# EAGLE design PuM_Arduino_Shield_v2 (EAGLE 7.3.0)
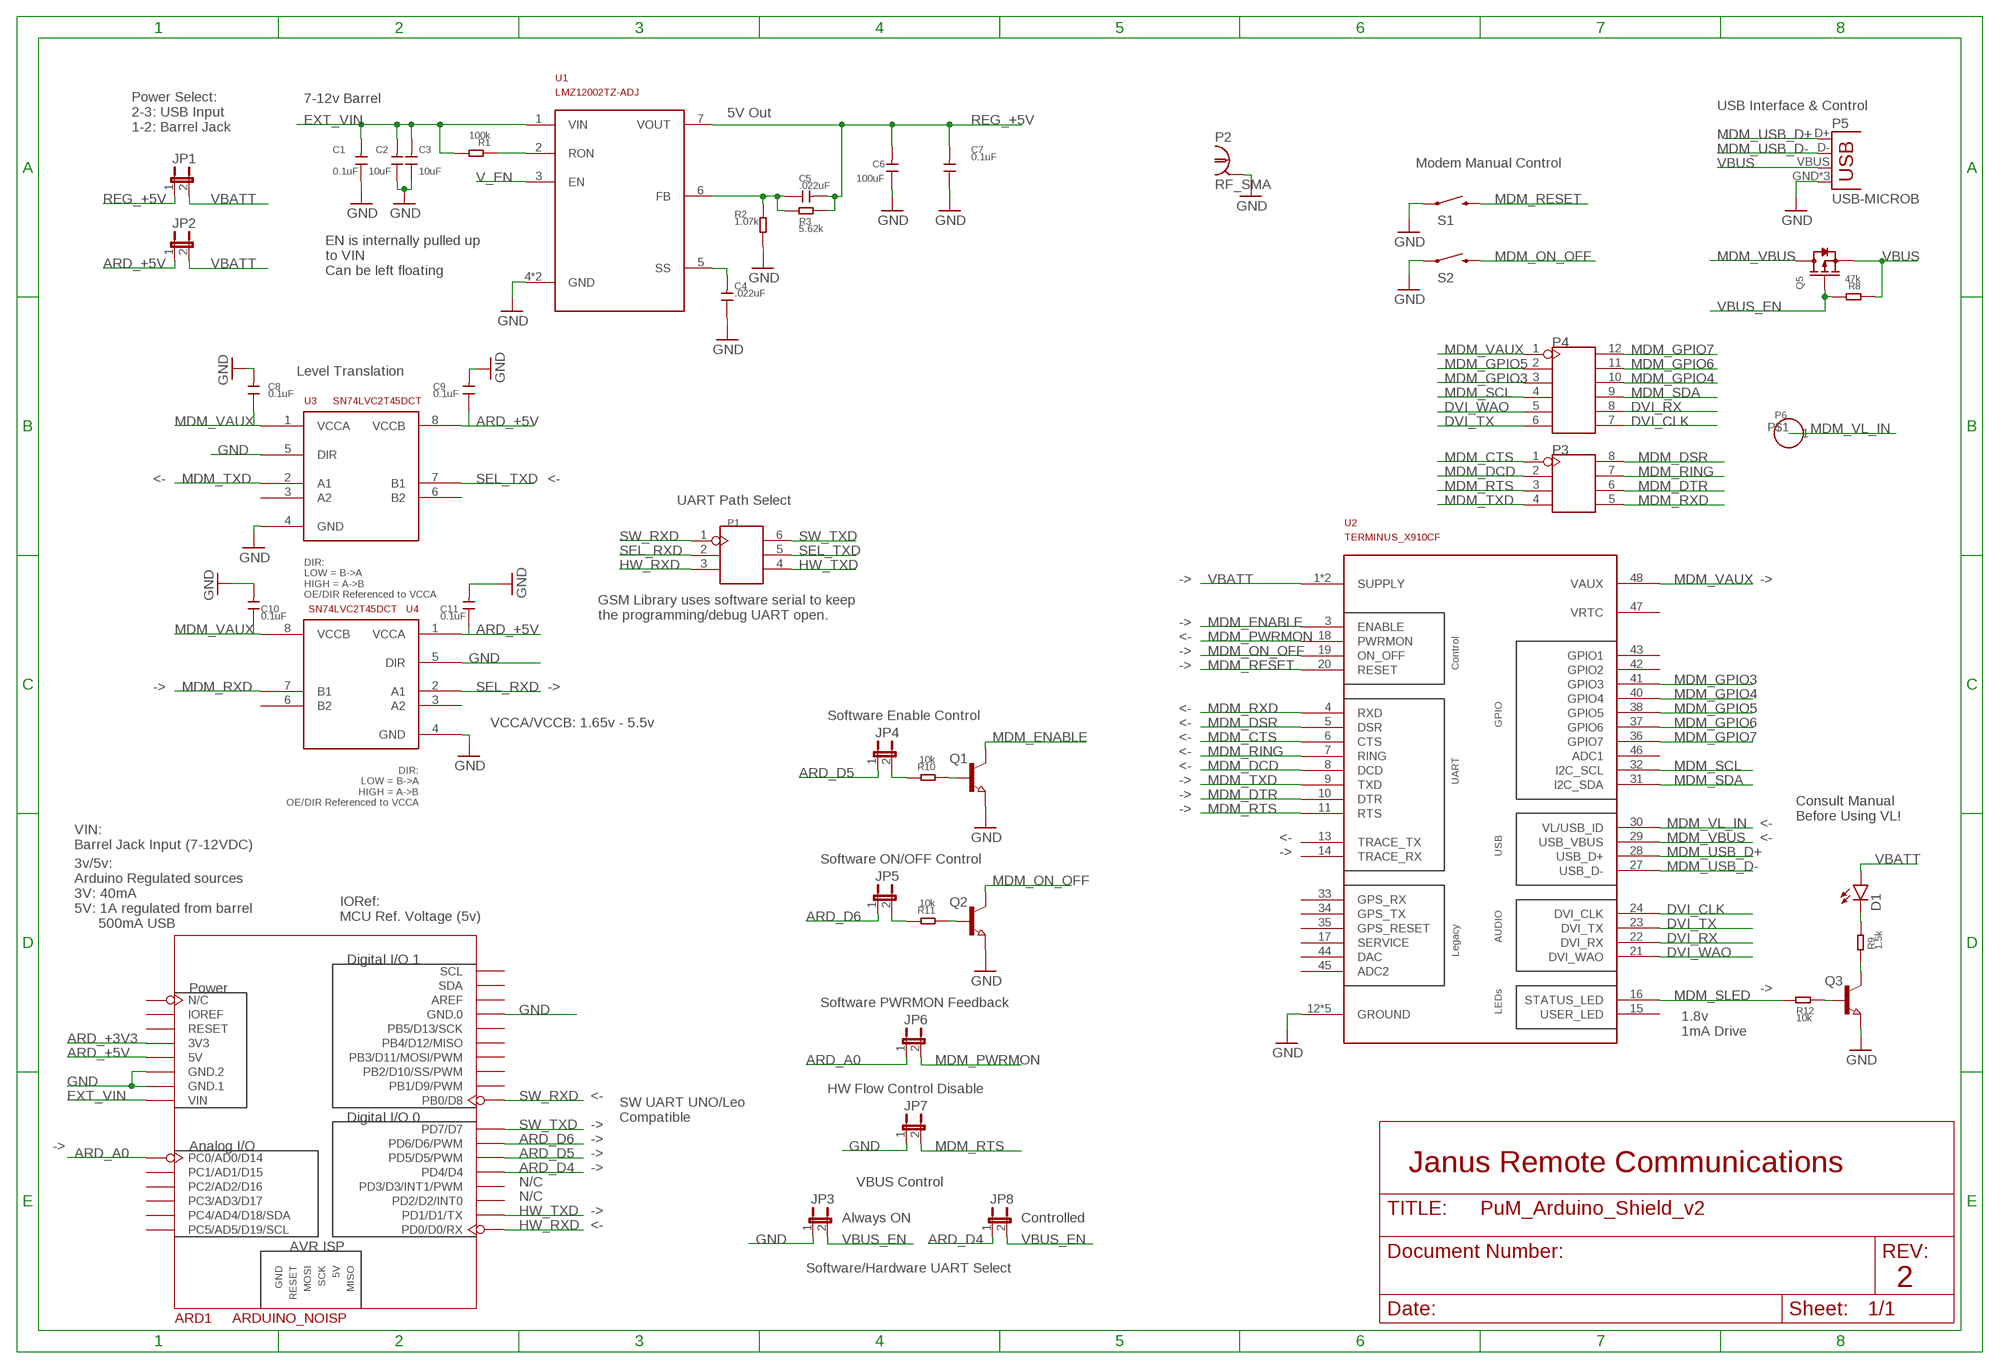
[diagram p0: schematic, sheet 1]

## Parts
ARD1  ARDUINO_NOISP  [ARDUINO_NOISP]
C1  0.1uF  C-0402  [C0402]
C2  10uF  C-0805  [C0805]
C3  10uF  C-0805  [C0805]
C4  .022uF  C-0402  [C0402]
C5  .022uF  C-0402  [C0402]
C6  100uF  C-1206  [C1206]
C7  0.1uF  C-0402  [C0402]
C8  0.1uF  C-0402  [C0402]
C9  0.1uF  C-0402  [C0402]
C10  0.1uF  C-0402  [C0402]
C11  0.1uF  C-0402  [C0402]
D1  LED0603  [LED-0603]
JP1  JUMPER-2SMD-NC  [SJ_2S]
JP2  JUMPER-2SMD-NO  [SJ_2S-NO]
JP3  JUMPER-2SMD-NO  [SJ_2S-NO]
JP4  JUMPER-2SMD-NC  [SJ_2S]
JP5  JUMPER-2SMD-NC  [SJ_2S]
JP6  JUMPER-2SMD-NC  [SJ_2S]
JP7  JUMPER-2SMD-NC  [SJ_2S]
JP8  JUMPER-2SMD-NC  [SJ_2S]
P1  HEADER-2X3P-2.54  [2X3P-2.54]
P2  RF_SMA  [RF_SMA_NOPIN]
P3  HEADER-2X4P-2.54  [2X4P-2.54]
P4  HEADER-2X6P-2.54  [2X6P-2.54]
P5  USB-MICROB  [USB-MICROB]
P6  HEADER-1P-35  [1P-65/35MIL]
Q1  NPN-TRANSISTOR_SOT23  [SOT23]
Q2  NPN-TRANSISTOR_SOT23  [SOT23]
Q3  NPN-TRANSISTOR_SOT23  [SOT23]
Q5  MOSFET-P'SI2323CDS/SI2305DS<BR>'  [SOT23]
R1  100k  R-0402  [R0402]
R2  1.07k  R-0402  [R0402]
R3  5.62k  R-0402  [R0402]
R8  47k  R-0402  [R0402]
R9  1.5k  R-0402  [R0402]
R10  10k  R-0402  [R0402]
R11  10k  R-0402  [R0402]
R12  10k  R-0402  [R0402]
S1  SWITCH-MOMENTARY-2SIDE_EZ  [TACTILE-PTH-SIDEEZ]
S2  SWITCH-MOMENTARY-2SIDE_EZ  [TACTILE-PTH-SIDEEZ]
U1  LMZ12002TZ-ADJ  [TO-PMOD-7]
U2  TERMINUS_X910CF  [X910CF]
U3  SN74LVC2T45DCT  [LSSOP-8]
U4  SN74LVC2T45DCT  [LSSOP-8]

## Nets
ARD_+3V3: ARD1.3V3
ARD_+5V: ARD1.5V C9.1 C11.1 JP2.1 U3.8(VCCB) U4.1(VCCA)
ARD_A0: ARD1.A0(PC0/AD0/D14) JP6.1
ARD_D4: ARD1.D4(PD4/D4) JP8.1
ARD_D5: ARD1.D5(PD5/D5/PWM) JP4.1
ARD_D6: ARD1.D6(PD6/D6/PWM) JP5.1
DVI_CLK: P4.7 U2.24(DVI_CLK)
DVI_RX: P4.8 U2.22(DVI_RX)
DVI_TX: P4.6 U2.23(DVI_TX)
DVI_WAO: P4.5 U2.21(DVI_WAO)
EXT_VIN: ARD1.VIN C1.2 C2.2 C3.2 R1.2 U1.1(VIN)
GND: ARD1.GND0(GND.0) ARD1.GND1(GND.1) ARD1.GND2(GND.2) C1.1 C2.1 C3.1 C4.1 C6.1 C7.1 C8.2 C9.2 C10.2 C11.2 JP3.1 JP7.1 P2.2 P2.3 P2.4 P2.5 P5.GND P5.MT1(GND) P5.MT2(GND) Q1.2(E) Q2.2(E) Q3.2(E) R2.2 S1.1 S2.1 U1.4(GND) U1.EP(GND) U2.12(GROUND) U2.25(GROUND) U2.26(GROUND) U2.39(GROUND) U2.49(GROUND) U3.4(GND) U3.5(DIR) U4.4(GND) U4.5(DIR)
HW_RXD: ARD1.D0(PD0/D0/RX) P1.3
HW_TXD: ARD1.D1(PD1/D1/TX) P1.4
MDM_CTS: P3.1 U2.6(CTS)
MDM_DCD: P3.2 U2.8(DCD)
MDM_DSR: P3.8 U2.5(DSR)
MDM_DTR: P3.6 U2.10(DTR)
MDM_ENABLE: Q1.3(C) U2.3(ENABLE)
MDM_GPIO3: P4.3 U2.41(GPIO3)
MDM_GPIO4: P4.10 U2.40(GPIO4)
MDM_GPIO5: P4.2 U2.38(GPIO5)
MDM_GPIO6: P4.11 U2.37(GPIO6)
MDM_GPIO7: P4.12 U2.36(GPIO7)
MDM_ON_OFF: Q2.3(C) S2.2 U2.19(ON_OFF)
MDM_PWRMON: JP6.2 U2.18(PWRMON)
MDM_RESET: S1.2 U2.20(RESET)
MDM_RING: P3.7 U2.7(RING)
MDM_RTS: JP7.2 P3.3 U2.11(RTS)
MDM_RXD: P3.5 U2.4(RXD) U4.7(B1)
MDM_SCL: P4.4 U2.32(I2C_SCL)
MDM_SDA: P4.9 U2.31(I2C_SDA)
MDM_SLED: R12.2 U2.16(STATUS_LED)
MDM_TXD: P3.4 U2.9(TXD) U3.2(A1)
MDM_USB_D+: P5.D+ U2.28(USB_D+)
MDM_USB_D-: P5.D- U2.27(USB_D-)
MDM_VAUX: C8.1 C10.1 P4.1 U2.48(VAUX) U3.1(VCCA) U4.8(VCCB)
MDM_VBUS: Q5.3(D) U2.29(USB_VBUS)
MDM_VL_IN: P6.P$1 U2.30(VL/USB_ID)
N$1: Q3.3(C) R9.2
N$2: JP5.2 R11.1
N$3: R1.1 U1.2(RON)
N$4: C4.2 U1.5(SS)
N$5: C5.1 R2.1 R3.2 U1.6(FB)
N$6: D1.C R9.1
N$7: JP4.2 R10.1
N$8: Q1.1(B) R10.2
N$9: Q2.1(B) R11.2
N$10: Q3.1(B) R12.1
REG_+5V: C5.2 C6.2 C7.2 JP1.1 R3.1 U1.7(VOUT)
SEL_RXD: P1.2 U4.2(A1)
SEL_TXD: P1.5 U3.7(B1)
SW_RXD: ARD1.D8(PB0/D8) P1.1
SW_TXD: ARD1.D7(PD7/D7) P1.6
V_EN: U1.3(EN)
VBATT: D1.A JP1.2 JP2.2 U2.1(SUPPLY) U2.2(SUPPLY)
VBUS: P5.VBUS Q5.2(S) R8.2
VBUS_EN: JP3.2 JP8.2 Q5.1(G) R8.1
Unconnected: ARD1.A1(PC1/AD1/D15) ARD1.A2(PC2/AD2/D16) ARD1.A3(PC3/AD3/D17) ARD1.A4(PC4/AD4/D18/SDA) ARD1.A5(PC5/AD5/D19/SCL) ARD1.AREF ARD1.D2(PD2/D2/INT0) ARD1.D3(PD3/D3/INT1/PWM) ARD1.D9(PB1/D9/PWM) ARD1.D10(PB2/D10/SS/PWM) ARD1.D11(PB3/D11/MOSI/PWM) ARD1.D12(PB4/D12/MISO) ARD1.D13(PB5/D13/SCK) ARD1.IOREF ARD1.N/C ARD1.RST(RESET) ARD1.SCL ARD1.SDA U2.13(TRACE_TX) U2.14(TRACE_RX) U2.15(USER_LED) U2.17(SERVICE) U2.33(GPS_RX) U2.34(GPS_TX) U2.35(GPS_RESET) U2.42(GPIO2) U2.43(GPIO1) U2.44(DAC) U2.45(ADC2) U2.46(ADC1) U2.47(VRTC) U3.3(A2) U3.6(B2) U4.3(A2) U4.6(B2)

## Notes on the sheet
- 7-12v Barrel
- USB Interface & Control
- 5V Out
- Power Select:
  2-3: USB Input
  1-2: Barrel Jack
- Modem Manual Control
- EN is internally pulled up 
  to VIN
  Can be left floating
- Level Translation
- <- | <-
- UART Path Select
- -> | ->
- GSM Library uses software serial to keep 
  the programming/debug UART open.
- ->
- <-
- ->
- ->
- -> | ->
- <-
- Software Enable Control
- VCCA/VCCB: 1.65v - 5.5v | <-
- <-
- <-
- <-
- ->
- ->
- ->
- Consult Manual 
  Before Using VL!
- <-
- <- | <-
- VIN:
  Barrel Jack Input (7-12VDC)
- ->
- Software ON/OFF Control
- IORef:
  MCU Ref. Voltage (5v)
- 3v/5v:
  Arduino Regulated sources
  3V: 40mA
  5V: 1A regulated from barrel
        500mA USB
- ->
- Software PWRMON Feedback
- 1.8v
  1mA Drive
- HW Flow Control Disable
- <-
- SW UART UNO/Leo
  Compatible
- ->
- ->
- ->
- ->
- -> | Janus Remote Communications
- N/C | VBUS Control
- N/C
- ->
- Always ON | Controlled
- <-
- Software/Hardware UART Select
- 2

## Library data of the parts
ARD1 = Janus-IC:ARDUINO
C1-C11 = Discrete:C*: Ceramic Capacitors
D1 = SparkFun-LED:LED: LEDs Standard schematic elements and footprints for 5mm, 3mm, 1206, and 0603 sized LEDs. 5mm - Spark Fun Electronics SKU : COM-00529 (and others)
JP1-JP8 = SparkFun-Retired:JUMPER-2: Jumper Basic 0.1" spaced jumper. Use with breakaway headers.
P1 = Connector:HEADER-2X3P
P2 = Janus-IC:RF_SMA: SMA Bulkhead connector
P3 = Connector:HEADER-2X4P
P4 = Connector:HEADER-2X6P
P5 = SparkFun-Connectors:USB: USB Connectors USB-B-PTH is fully proven SKU : PRT-00139/CONN-08278 USB-miniB is fully proven SKU : PRT-00587 USB-A-PCB is untested. USB-A-H is throughly reviewed, but untested. Spark Fun Electronics SKU : PRT-00437 USB-B-SMT is throughly reviewed, but untested. Needs silkscreen touching up. USB-A-S has not been used/tested USB-MB-H has not been used/tested USB-MICROB has been used. CONN-09505; PROD_ID: CONN-09505
P6 = Connector:HEADER-1P
Q1-Q3 = semicon-smd-ipc:NPN-TRANSISTOR_: NPN TRANSISTOR
Q5 = Discrete:MOSFET-P
R1-R3 R8-R12 = Discrete:R*
S1 S2 = SparkFun-Electromechanical:SWITCH-MOMENTARY-2: Various NO switches- pushbuttons, reed, etc
U1 = Janus-IC:LMZ12002TZ-ADJ: TI 2A Simple Switcher Power Module 20V Max Input, 0.8v - 6v Output Up to 92% Efficient
U2 = Janus-IC:TERMINUS_X910CF: Terminus x910CF Plug in Module Footprint/Schematic for: HSPA910CF EVDO910CF CDMA910CF LTE910CF
U3 U4 = Janus-IC:SN74LVC2T45: Dual-Bit Dual-Supply Bus Transceiver, 3 State Outputs

## Net classes
0 default: clearance 0.152 mm

## Board
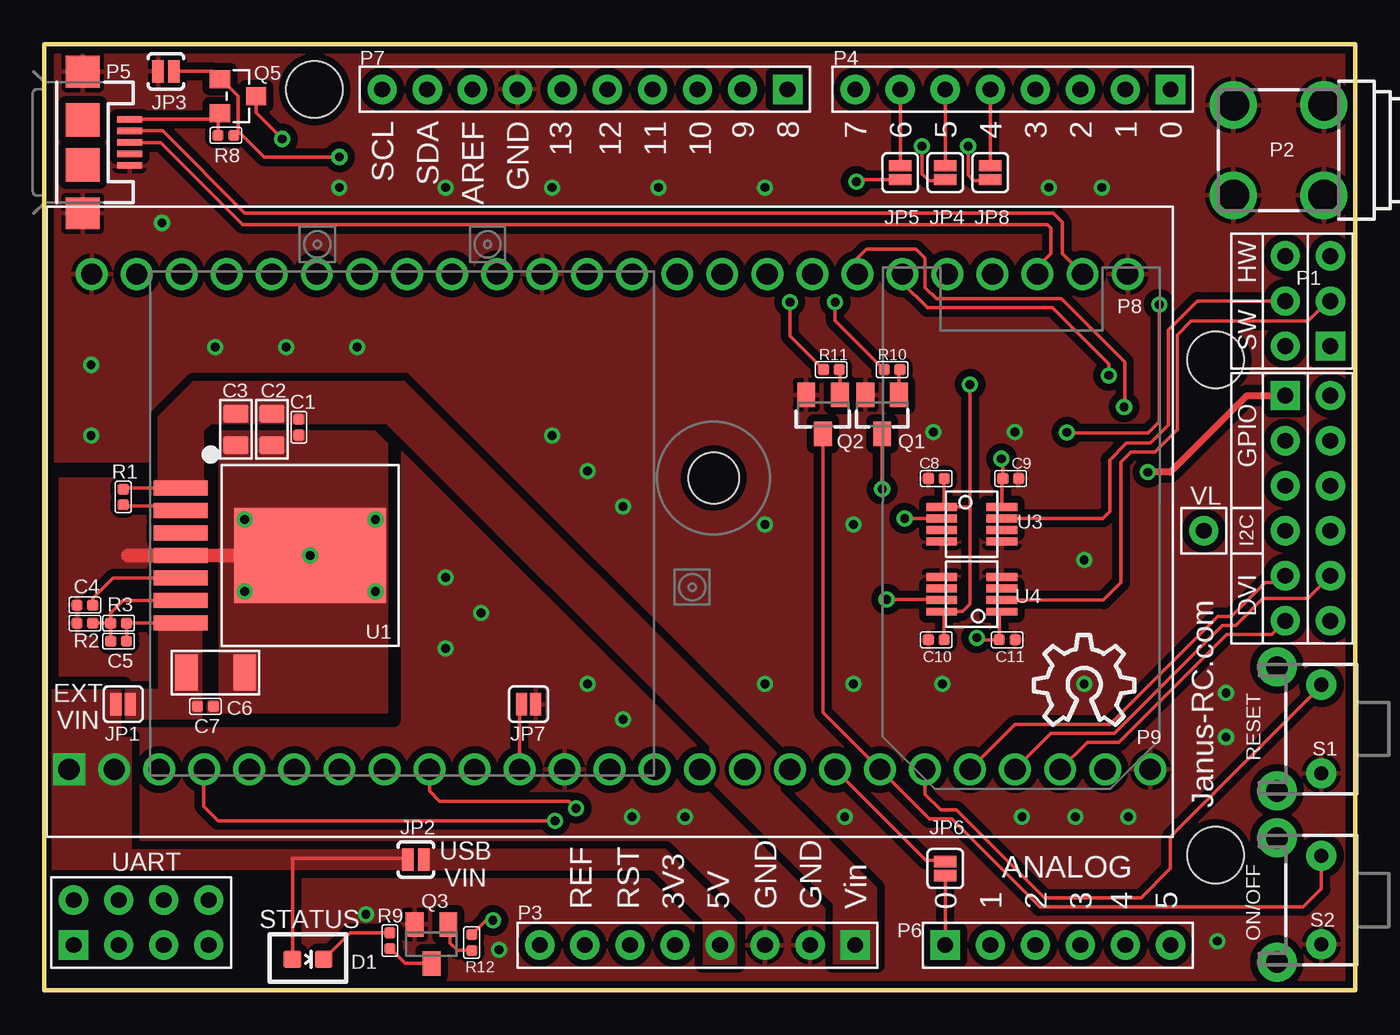
[diagram p1: board, top side]
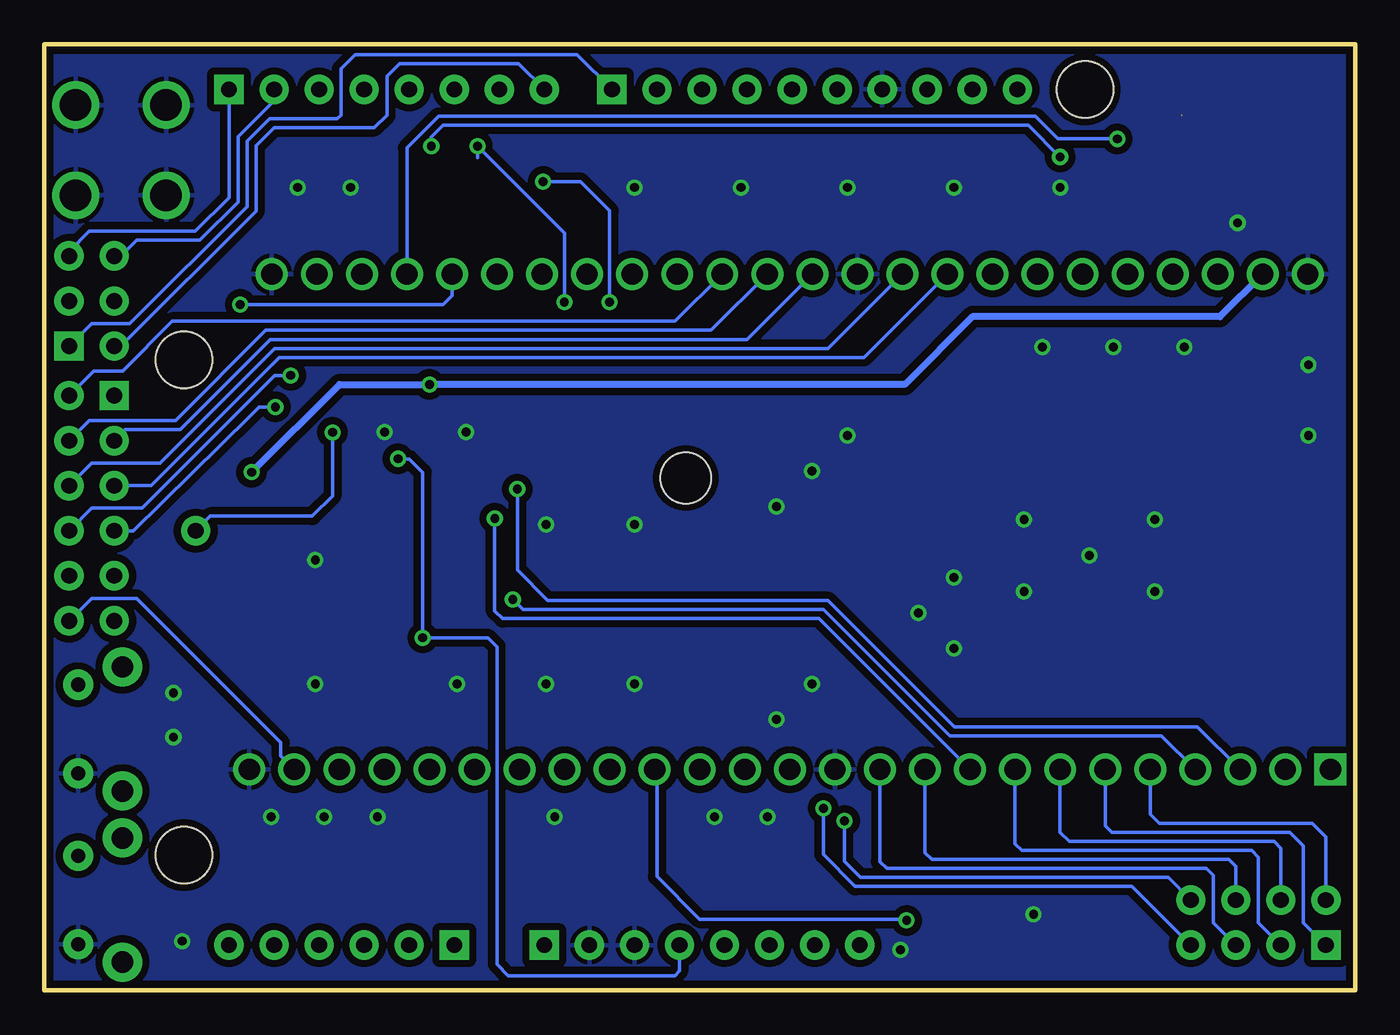
[diagram p2: board, bottom side, seen from below]

Size 73.91 x 53.34 mm. Coordinates in mm from the lower left corner, seen from the top.
Outline: 0,53.34 0,0 73.91,0 73.91,53.34 0,53.34
Copper layers (1*16): Top 0.035mm / dielectric 1.5mm / Bottom 0.035mm
Design rules "JanusDRU *": minimum track width 6mil, minimum drill 0.5mm, track to track 8mil, track to pad 8mil, pad to pad 8mil, via to via 8mil, smd to smd 8mil, copper to edge 10mil, drill to drill 8mil, minimum pad ring 10mil, minimum via ring 8mil, stop-mask expansion 4mil, vias tented up to drill 0.5mm, thermal gap 10mil
tRestrict: 49 lines

### Footprints (pad centres in the part's own frame; a part is rotated, then mirrored left to right if it is on the bottom)
ARDUINO_NOISP = drill 0.889 pad 1.651: 3V3 35.56,-50.8; 5V 38.1,-50.8; A1 53.34,-50.8; A2 55.88,-50.8; A3 58.42,-50.8; A4 60.96,-50.8; A5 63.5,-50.8; AREF 24.13,-2.54; D1 60.96,-2.54; D2 58.42,-2.54; D3 55.88,-2.54; D4 53.34,-2.54; D5 50.8,-2.54; D6 48.26,-2.54; D7 45.72,-2.54; D9 39.37,-2.54; D10 36.83,-2.54; D11 34.29,-2.54; D12 31.75,-2.54; D13 29.21,-2.54; GND0 26.67,-2.54; GND1 43.18,-50.8; GND2 40.64,-50.8; IOREF 30.48,-50.8; N/C 27.94,-50.8; RST 33.02,-50.8; SCL 19.05,-2.54; SDA 21.59,-2.54 | drill 0.889 pad 1.651 square: A0 50.8,-50.8; D0 63.5,-2.54; D8 41.91,-2.54; VIN 45.72,-50.8 | hole 3.2: 15.24,-2.54; 66.04,-17.78; 66.04,-45.72
C0402 = smd 0.635 x 0.635: 1 -0.445,0; 2 0.445,0
C0805 = smd 1.016 x 1.397: 1 -0.889,0; 2 0.889,0
C1206 = smd 1.27 x 2.032: 1 -1.651,0; 2 1.651,0
LED-0603 = smd 1 x 1: A 0,-0.877; C 0,0.877
SJ_2S = smd 0.635 x 1.27: 1 -0.399,0; 2 0.399,0
SJ_2S-NO = smd 0.635 x 1.27: 1 -0.45,0; 2 0.45,0
2X3P-2.54 = drill 0.889 pad 1.651 square: 1 -1.27,2.54 | drill 0.889 pad 1.651: 2 -1.27,0; 3 -1.27,-2.54; 4 1.27,-2.54; 5 1.27,0; 6 1.27,2.54
RF_SMA_NOPIN = drill 1.778: 2 -2.55,2.55; 3 2.55,2.55; 4 2.55,-2.55; 5 -2.55,-2.55
2X4P-2.54 = drill 0.889 pad 1.651 square: 1 -1.27,3.81 | drill 0.889 pad 1.651: 2 -1.27,1.27; 3 -1.27,-1.27; 4 -1.27,-3.81; 5 1.27,-3.81; 6 1.27,-1.27; 7 1.27,1.27; 8 1.27,3.81
2X6P-2.54 = drill 0.889 pad 1.651 square: 1 -1.27,6.35 | drill 0.889 pad 1.651: 2 -1.27,3.81; 3 -1.27,1.27; 4 -1.27,-1.27; 5 -1.27,-3.81; 6 -1.27,-6.35; 7 1.27,-6.35; 8 1.27,-3.81; 9 1.27,-1.27; 10 1.27,1.27; 11 1.27,3.81; 12 1.27,6.35
USB-MICROB = smd 0.35 x 1.4: D+ 0,2.65; D- -0.65,2.65; GND 1.3,2.65; ID 0.65,2.65; VBUS -1.3,2.65 | smd 1.8 x 1.9: MT1 -4,0; MT2 4,0 | smd 1.9 x 1.9: P$1 -1.27,0; P$2 1.27,0
1P-65/35MIL = drill 0.889 pad 1.651: P$1 0,0
SOT23 = smd 1 x 1.4: 1 -0.95,-1.1; 2 0.95,-1.1; 3 0,1.1
SOT23' = smd 1.016 x 1.143: 1 -0.95,-1.016; 2 0.95,-1.016; 3 0,1.016
R0402 = smd 0.635 x 0.635: 1 -0.445,0; 2 0.445,0
TACTILE-PTH-SIDEEZ = drill 0.8 pad 1.7: 1 -2.5,0; 2 2.5,0 | drill 1.2 pad 2.2: ANCHOR1 -3.5,2.5; ANCHOR2 3.5,2.5
TO-PMOD-7 = smd 0.85 x 3.06: 1 -3.81,-7.3; 2 -2.54,-7.3; 3 -1.27,-7.3; 4 0,-7.3; 5 1.27,-7.3; 6 2.54,-7.3; 7 3.81,-7.3 | smd 5.35 x 8.57: EP 0,0
X910CF = drill 1.2 square: 1 0,0 | drill 1.2: 2 2.54,0; 3 5.08,0; 4 7.62,0; 5 10.16,0; 6 12.7,0; 7 15.24,0; 8 17.78,0; 9 20.32,0; 10 22.86,0; 11 25.4,0; 12 27.94,0; 13 30.48,0; 14 33.02,0; 15 35.56,0; 16 38.1,0; 17 40.64,0; 18 43.18,0; 19 45.72,0; 20 48.26,0; 21 50.8,0; 22 53.34,0; 23 55.88,0; 24 58.42,0; 25 60.96,0; 26 59.69,27.94; 27 57.15,27.94; 28 54.61,27.94; 29 52.07,27.94; 30 49.53,27.94; 31 46.99,27.94; 32 44.45,27.94; 33 41.91,27.94; 34 39.37,27.94; 35 36.83,27.94; 36 34.29,27.94; 37 31.75,27.94; 38 29.21,27.94; 39 26.67,27.94; 40 24.13,27.94; 41 21.59,27.94; 42 19.05,27.94; 43 16.51,27.94; 44 13.97,27.94; 45 11.43,27.94; 46 8.89,27.94; 47 6.35,27.94; 48 3.81,27.94; 49 1.27,27.94 | hole 2.87: 36.347,16.434
LSSOP-8 = smd 0.44 x 1.74: 1 0,0; 2 0.65,0; 3 1.3,0; 4 1.95,0; 5 1.95,3.4; 6 1.3,3.4; 7 0.65,3.4; 8 0,3.4

### Placement (x,y rotation side)
ARD1  0,53.34 0 top
C1  14.35,31.75 90 top
C2  12.83,31.62 90 top
C3  10.8,31.62 90 top
C4  2.29,21.72 0 top
C5  4.19,19.68 0 top
C6  9.65,17.91 180 top
C7  9.08,16 180 top
C8  50.29,28.86 180 top
C9  54.49,28.86 0 top
C10  50.29,19.76 180 top
C11  54.29,19.76 0 top
D1  14.87,1.74 270 top
DRILEGEND  [DRILEGEND]  -1.52,-4.25 0 top  (outside the outline)
JP1  4.45,16.13 180 top
JP2  20.96,7.37 180 top
JP3  6.86,51.82 0 top
JP4  50.8,46.1 270 top
JP5  48.26,46.1 270 top
JP6  50.8,6.86 90 top
JP7  27.3,16.13 180 top
JP8  53.34,46.1 270 top
P1  71.25,38.86 180 top
P2  69.6,47.37 0 top
P3  5.46,3.81 90 top
P4  71.25,27.18 0 top
P5  2.16,47.81 270 top
P6  65.38,25.91 0 top
Q1  47.24,32.47 180 top
Q2  43.91,32.47 180 top
Q3  21.83,2.6 180 top
Q5  [SOT23']  10.92,50.42 270 top
R1  4.45,27.81 90 top
R2  2.29,20.7 180 top
R3  4.19,20.7 180 top
R8  10.24,48.21 180 top
R9  19.48,2.79 270 top
R10  47.8,35 0 top
R11  44.38,35 0 top
R12  24.1,2.68 90 top
S1  72.01,14.73 90 top
S2  72.01,5.08 90 top
U1  14.99,24.51 270 top
U2  1.4,12.45 0 top
U3  50.6,27.25 270 top
U4  54,21.35 90 top
U$2  [OSHW_10X200_NOTEXT]  55.79,14.96 0 top

### Tracks (layer width: path | path; a pad name or v marks a point on that pad's centre or on a via)
ARD_+5V  (via drill 0.5)
  Top 0.203: U4.1 53.97,21.4 53.85,21.4 C11.1 52.57,19.76 v52.57,19.88 | v53.97,29.97 54.05,29.97 C9.1 54,28.86 U3.8
  Bottom 0.203: v53.97,29.97 53.34,29.97 52.58,29.2 v52.58,19.88 v52.57,19.88 48.89,19.88 48.39,19.37 48.39,1.46 47.75,0.83 38.35,0.83 38.1,1.08 ARD1.5V
  pour Top (no thermals): 39.12,1.4 37.08,1.4 37.08,3.94 34.29,6.73 21.08,6.73 21.08,8 35.05,8 39.12,3.94
ARD_A0
  Top 0.203: ARD1.A0 JP6.1
ARD_D4
  Top 0.203: JP8.1 ARD1.D4
ARD_D5
  Top 0.203: JP4.1 ARD1.D5
ARD_D6
  Top 0.203: JP5.1 ARD1.D6
DVI_CLK
  Bottom 0.203: U2.24 60.58,13.21 60.58,13.97 68.71,22.1 71.25,22.1 P4.7
DVI_RX
  Top 0.203: U2.22 56.77,14.48 60.32,14.48 66.42,20.57 67.18,20.57 68.71,22.1 71.25,22.1 P4.8
DVI_TX
  Top 0.203: U2.23 58.8,13.97 60.58,13.97 66.68,20.07 69.22,20.07 P4.6
DVI_WAO
  Top 0.203: U2.21 54.74,14.99 60.07,14.99 66.17,21.08 66.93,21.08 68.83,22.99 69.6,22.99 P4.5
EXT_VIN
  Top 0.203: R1.2 4.51,28.32 U1.1
  pour Top (no thermals): 46.99,1.4 46.99,5.84 41.53,11.3 41.53,13.21 20.32,34.42 8.38,34.42 6.35,32.39 6.35,28.07 9.02,28.07 9.02,31.5 9.5,31.98 19.2,31.98 37.46,13.72 37.46,11.81 44.45,4.83 44.45,1.4
GND  (via drill 0.5)
  Top 0.762: 4.7,24.51 U1.4 11.68,24.51
  other vias: 14.99,24.51 18.67,26.54 18.67,22.48 11.3,22.48 11.3,26.54 2.63,35.27 2.63,31.27 22.63,23.27 22.63,19.27 24.63,21.27 28.63,31.27 30.63,29.27 32.63,27.27 6.63,43.27 28.63,45.27 34.63,45.27 40.63,45.27 22.63,45.27 16.63,45.27 50.63,17.27 58.63,17.27 40.63,17.27 45.63,17.27 45.63,26.27 40.63,26.27 58.63,24.27 9.63,36.27 13.63,36.27 17.63,36.27 30.63,17.27 32.63,15.27 33.13,9.77 36.13,9.77 25.63,2.27 18.13,4.27 55.13,9.77 58.13,9.77 61.13,9.77 45.13,9.77 66.13,2.77 66.63,14.27 66.63,16.77 56.63,45.27 59.63,45.27 54.73,31.47 50.13,31.47
  pour Top (isolate 0.406): -0.38,53.72 74.3,53.72 74.3,-0.38 -0.38,-0.38
  pour Bottom (isolate 0.406): -0.38,53.72 74.3,53.72 74.3,-0.38 -0.38,-0.38
  pour Top (no thermals): 9.91,31.5 18.61,31.5 19.3,30.8 19.3,15.68 9.27,15.68 9.27,16.26 9.91,16.26
HW_RXD
  Bottom 0.203: ARD1.D0 63.5,44.7 65.41,42.8 71.37,42.8 72.52,41.66 P1.3
HW_TXD
  Bottom 0.203: ARD1.D1 60.96,50.16 62.99,48.13 62.99,44.45 65.15,42.29 68.71,42.29 69.6,41.4 P1.4
MDM_CTS
  Bottom 0.203: U2.6 14.1,9.27 13.72,8.89 3.68,8.89 2.92,8.13 2.92,3.81 P3.1
MDM_DCD
  Bottom 0.203: U2.8 19.18,8.26 18.8,7.87 5.84,7.87 5.46,7.49 5.46,3.81 P3.2
MDM_DSR
  Bottom 0.203: U2.5 11.56,9.91 11.05,9.4 2.41,9.4 1.65,8.64 P3.8
MDM_DTR
  Bottom 0.203: U2.10 24.26,7.75 23.88,7.37 7.11,7.37 6.73,6.98 P3.6
MDM_ENABLE  (via drill 0.5)
  Top 0.203: v47.24,28.26 Q1.3
  Bottom 0.203: U2.3 8.89,14.86 22.61,14.86 29.72,21.97 45.53,21.97 47.24,23.69 v47.24,28.26
MDM_GPIO3
  Bottom 0.203: U2.41 27.69,35.69 60.66,35.69 67.9,28.45 P4.3
MDM_GPIO4
  Bottom 0.203: U2.40 29.72,36.19 60.91,36.19 67.39,29.72 71.25,29.72 P4.10
MDM_GPIO5
  Bottom 0.203: U2.38 34.29,36.7 61.17,36.7 66.25,31.62 69.34,31.62 P4.2
MDM_GPIO6
  Bottom 0.203: U2.37 36.32,37.21 61.42,37.21 66.5,32.13 71.37,32.13 P4.11
MDM_GPIO7
  Bottom 0.203: U2.36 38.35,37.72 66.69,37.72 69.49,34.93 71.12,34.93 P4.12
MDM_ON_OFF
  Top 0.203: S2.2 72.01,5.72 70.99,4.7 56.13,4.7 51.18,9.65 49.91,9.65 U2.19 43.91,15.65 Q2.3
MDM_PWRMON
  Top 0.203: U2.18 49.71,7.31 50.8,7.31 JP6.2
MDM_RESET
  Top 0.203: S1.2 71.84,16.98 63.5,8.64 63.5,6.86 61.85,5.21 56.39,5.21 51.43,10.16 50.55,10.16 49.66,11.05 U2.20
MDM_RING
  Bottom 0.203: U2.7 16.64,8.89 16.13,8.38 4.57,8.38 4.19,8 P3.7
MDM_RTS
  Top 0.203: 26.8,16.03 JP7.2 26.8,16.13 U2.11
  Bottom 0.203: U2.11 26.8,7.24 26.42,6.86 8.38,6.86 8,6.48 8,3.81 P3.3
MDM_RXD  (via drill 0.5)
  Top 0.203: v28.79,9.56 9.79,9.56 8.99,10.36 8.99,12.42 U2.4 | v47.5,22.03 50.6,22.03 U4.7
  Bottom 0.203: U2.4 10.92,14.35 22.86,14.35 29.97,21.46 46.93,21.46 v47.5,22.03 | P3.5 10.55,6.36 27.89,6.36 28.79,7.26 v28.79,9.56
MDM_SCL  (via drill 0.5)
  Top 0.203: v60.89,32.89 60.91,32.92 60.91,35.43 57.36,38.99 50.29,38.99 49.66,39.62 49.66,41.27 49.15,41.78 46.35,41.78 45.85,41.27 U2.32
  Bottom 0.203: P4.4 68.92,25.91 62.31,32.39 61.8,32.89 v60.89,32.89
MDM_SDA  (via drill 0.5)
  Top 0.203: U2.31 48.39,39.88 49.78,38.48 56.85,38.48 60.02,35.31 v60.02,34.67
  Bottom 0.203: P4.9 71.25,27.18 68.41,27.18 60.91,34.67 v60.02,34.67
MDM_SLED  (via drill 0.5)
  Top 0.203: R12.2 24.9,3.94 v25.29,3.94
  Bottom 0.203: U2.16 39.37,12.32 39.37,6.41 36.96,4 25.36,4 v25.29,3.94
MDM_TXD  (via drill 0.5)
  Top 0.203: v48.51,26.61 U3.2 | v29.99,10.26 29.59,10.66 22.29,10.66 21.72,11.23 U2.9
  Bottom 0.203: U2.9 30.23,20.95 48.07,20.95 48.51,21.4 v48.51,26.61 | P3.4 12.59,5.86 28.19,5.86 29.99,7.66 v29.99,10.26
MDM_USB_D+
  Top 0.203: U2.28 56.01,40.77 56.77,41.53 56.77,42.98 56.57,43.18 11.18,43.18 6.55,47.81 P5.D+
MDM_USB_D-
  Top 0.203: U2.27 57.4,41.53 57.4,43.31 56.9,43.82 11.3,43.82 6.66,48.46 P5.D-
MDM_VAUX  (via drill 0.5)
  Top 0.203: v52.2,34.16 52.2,27.24 | 52.2,27.24 52.2,21.78 51.77,21.35 U4.8 50.74,21.35 C10.1 | 52.2,27.24 52.18,27.25 U3.1 50.74,27.25 C8.1
  Top 0.406: P4.1 67.82,33.53 63.5,29.21 v62.23,29.21
  Bottom 0.406: U2.48 7.62,37.97 21.59,37.97 25.4,34.16 v52.2,34.16 57.28,34.16 v62.23,29.21
MDM_VBUS  (via drill 0.5)
  Top 0.203: v13.41,48.01 11.94,49.48 Q5.3
  Bottom 0.203: U2.29 53.47,47.5 51.69,49.28 18.03,49.28 16.76,48.01 v13.41,48.01
MDM_VL_IN  (via drill 0.5)
  Top 0.203: v62.86,38.67 62.86,32.07 62.23,31.43 57.66,31.43 v57.66,31.46
  Bottom 0.203: v62.86,38.67 51.43,38.67 50.93,39.18 U2.30 | v57.66,31.46 57.66,27.88 58.8,26.73 64.55,26.73 P6.P$1
N$1
  Top 0.203: Q3.3 20.33,1.5 R9.2
N$2  (via drill 0.5)
  Top 0.203: R11.1 42.04,36.89 v42.04,38.81 | 45.79,45.73 v45.79,45.61 45.79,45.7 JP5.2
  Bottom 0.203: v42.04,38.81 42.04,43.96 43.69,45.61 v45.79,45.61
N$3
  Top 0.203: U1.2 7.69,27.24 7.62,27.31 4.51,27.31 R1.1
N$4
  Top 0.203: U1.5 3.87,23.24 2.73,22.1 C4.2
N$5
  Top 0.203: R2.1 R3.2 | R3.2 3.75,21.27 4.45,21.97 U1.6 | C5.1 R3.2
N$6
  Top 0.203: R9.1 17.25,3.24 D1.C
N$7  (via drill 0.5)
  Top 0.203: R10.1 44.59,37.76 v44.59,38.81 | v49.49,47.61 49.49,46.06 49.89,45.66 50.8,45.66 JP4.2 50.79,45.66
  Bottom 0.203: 49.49,46.96 v49.49,47.61 44.59,42.71 v44.59,38.81
N$8
  Top 0.203: R10.2 48.19,34.95 Q1.1
N$9
  Top 0.203: R11.2 44.86,34.96 Q2.1
N$10
  Top 0.203: 22.58,3.91 Q3.1 22.89,3.59 22.89,2.66 23.31,2.24 R12.1
REG_+5V
  Top 0.203: C5.2 R3.1 U1.7
  pour Top (no thermals): 8.95,20.95 8.95,15.24 4.61,15.24 4.61,17.02 6.35,17.02 6.35,20.95
SEL_RXD
  Top 0.203: P1.2 72.39,38.86 71.25,37.72 64.64,37.72 63.88,36.96 63.88,31.62 62.61,30.35 61.28,30.35 60.71,29.78 60.71,22.99 59.72,22 U4.2
SEL_TXD
  Top 0.203: P1.5 65.02,38.86 63.37,37.21 63.37,31.88 62.36,30.86 61.02,30.86 60.07,29.91 60.07,26.99 59.69,26.61 U3.7
SW_RXD
  Bottom 0.203: P1.1 71.25,37.59 69.09,37.59 62.48,44.2 62.48,47.88 61.21,49.15 57.4,49.15 57.19,49.36 57.19,51.96 56.39,52.76 43.86,52.76 ARD1.D8
SW_TXD
  Bottom 0.203: P1.6 69.6,36.32 61.98,43.94 61.98,47.62 60.96,48.64 55.31,48.64 54.59,49.36 54.59,51.56 53.89,52.26 47.18,52.26 ARD1.D7
VBATT
  Top 0.203: D1.A 14,7.4 13.97,7.43 20.44,7.43 JP2.2
  pour Top (no thermals): 20.83,6.73 20.83,8 4.95,8 4.95,14.35 4.34,14.33 4.34,16.99 0.38,17.02 0.38,6.73
VBUS  (1 unrouted)
  Top 0.203: R8.2 9.79,49.35 | 9.74,49.31 Q5.2 9.54,49.11 P5.VBUS
VBUS_EN  (via drill 0.5)
  Top 0.203: R8.1 10.92,48.45 | 10.92,48.45 10.92,50.42 9.97,51.37 Q5.1 9.46,51.82 JP3.2 | 10.92,48.45 12.38,46.99 v16.64,46.99 | v52.09,47.61 52.09,45.96 52.39,45.66 53.34,45.66 JP8.2 53.34,45.66
  Bottom 0.203: v16.64,46.99 18.41,48.77 51.43,48.77 52.09,48.11 v52.09,47.61

### Text on the board
tPlace: HW | SW | GPIO | VL | I2C | DVI | EXT / VIN | RESET | Janus-RC.com | UART | USB / VIN | STATUS | ON/OFF
tNames: P7 | P4 | P1 | P8 | P9 | P3 | P6
DrillLegend_01-16: 01-16
DrillLegend_01-20: 01-20